# EAGLE design SchematicWeatherIC (EAGLE 9.6.2)
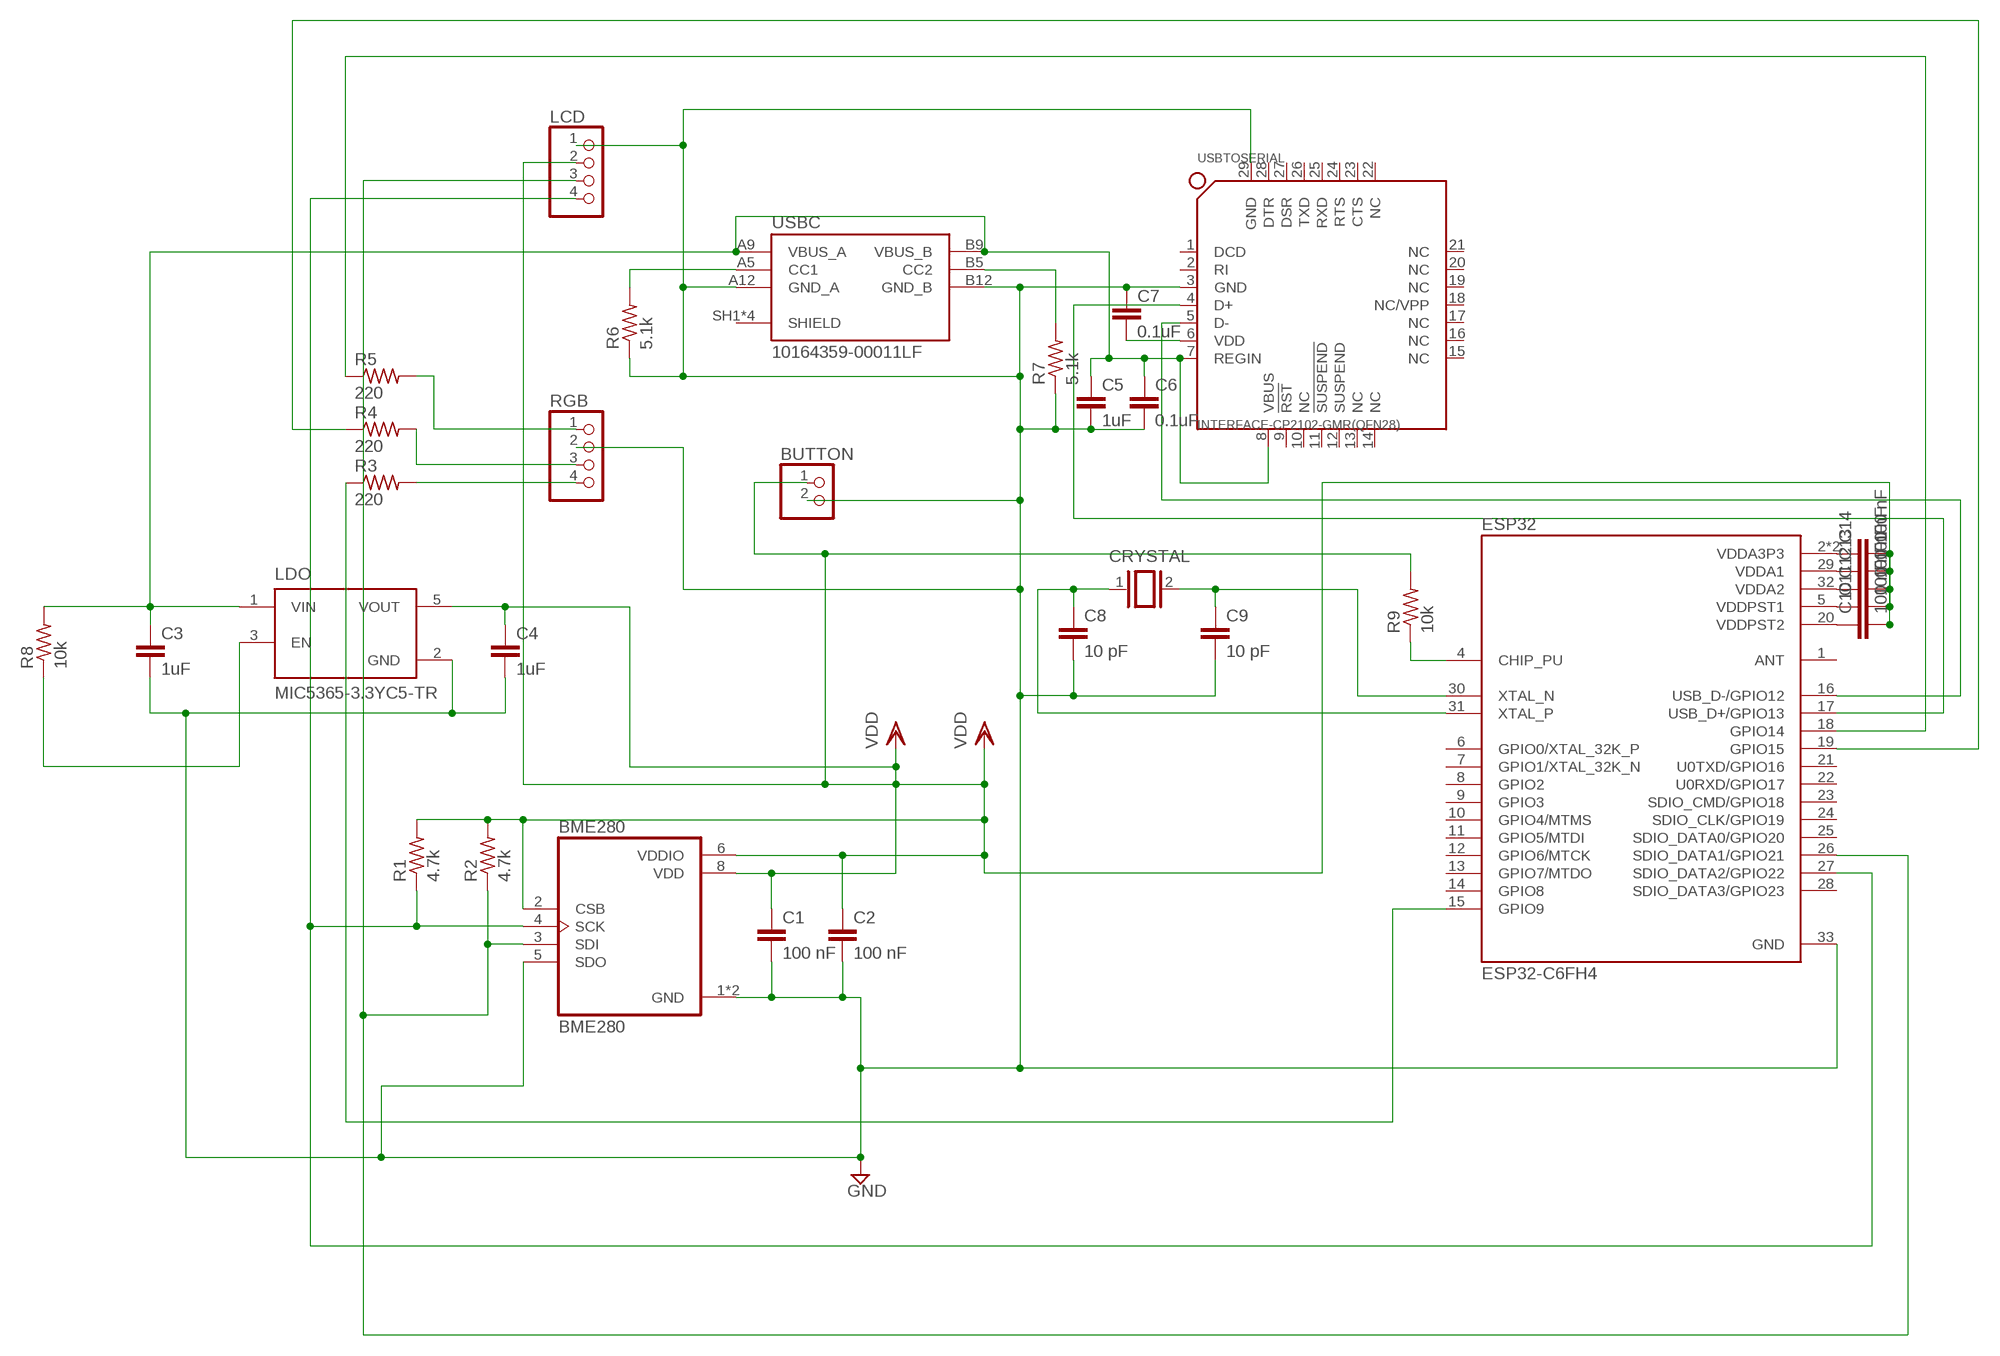
[diagram p0: schematic, sheet 1]

## Parts
BME280  BME280  [PSON65P250X250X100-8N]
BUTTON  PINHD-1X2  [1X02]
C1  100 nF  C5/3  [C5B3]
C2  100 nF  C5/3  [C5B3]
C3  1uF  C5/2.5  [C5B2.5]
C4  1uF  C5/2.5  [C5B2.5]
C5  1uF  C5/2.5  [C5B2.5]
C6  0.1uF  C5/2.5  [C5B2.5]
C7  0.1uF  C5/2.5  [C5B2.5]
C8  10 pF  C5/3  [C5B3]
C9  10 pF  C5/3  [C5B3]
C10  100 nF  C5/3  [C5B3]
C11  100 nF  C5/3  [C5B3]
C12  100 nF  C5/3  [C5B3]
C13  100 nF  C5/3  [C5B3]
C14  100 nF  C5/3  [C5B3]
CRYSTAL  XTAL/S  [QS]
ESP32  ESP32-C6FH4  [QFN50P500X500X90-33N]
LCD  PINHD-1X4  [1X04]
LDO  MIC5365-3.3YC5-TR  [SOT65P210X110-5N]
R1  4.7k  R-US_VMTA55  [VMTA55]
R2  4.7k  R-US_VMTA55  [VMTA55]
R3  220  R-US_VMTA55  [VMTA55]
R4  220  R-US_VMTA55  [VMTA55]
R5  220  R-US_VMTA55  [VMTA55]
R6  5.1k  R-US_VMTA55  [VMTA55]
R7  5.1k  R-US_VMTA55  [VMTA55]
R8  10k  R-US_VMTA55  [VMTA55]
R9  10k  R-US_VMTA55  [VMTA55]
RGB  PINHD-1X4  [1X04]
USBC  10164359-00011LF  [AMPHENOL_10164359-00011LF]
USBTOSERIAL  INTERFACE-CP2102-GMR(QFN28)  [QFN28G_0.5-5X5MM]

## Nets
D_N [differential_pair]: ESP32.16(USB_D-/GPIO12) USBTOSERIAL.5(D-)
D_P [differential_pair]: ESP32.17(USB_D+/GPIO13) USBTOSERIAL.4(D+)
GND: BME280.1(GND) BME280.5(SDO) BME280.7(GND) BUTTON.2 C1.2 C2.2 C3.2 C4.2 C5.2 C6.2 C7.1 C8.2 C9.2 ESP32.33(GND) LCD.1 LDO.2(GND) R6.1 R7.1 RGB.2 USBC.A12(GND_A) USBC.B12(GND_B) USBTOSERIAL.3(GND) USBTOSERIAL.29(GND)
N$1: ESP32.15(GPIO9) R3.1
N$2: C3.1 C5.1 C6.1 LDO.1(VIN) R8.2 USBC.A9(VBUS_A) USBC.B9(VBUS_B) USBTOSERIAL.7(REGIN) USBTOSERIAL.8(VBUS)
N$3: ESP32.4(CHIP_PU) R9.1
N$4: ESP32.18(GPIO14) R5.1
N$5: C7.2 USBTOSERIAL.6(VDD)
N$6: LDO.3(EN) R8.1
N$7: ESP32.19(GPIO15) R4.1
N$8: R3.2 RGB.4
N$9: R4.2 RGB.3
N$10: R5.2 RGB.1
N$11: C8.1 CRYSTAL.1 ESP32.31(XTAL_P)
N$12: R6.2 USBC.A5(CC1)
N$13: R7.2 USBC.B5(CC2)
N$14: C10.1 ESP32.20(VDDPST2)
N$15: C9.1 CRYSTAL.2 ESP32.30(XTAL_N)
N$16: C11.1 ESP32.5(VDDPST1)
N$17: C12.1 ESP32.32(VDDA2)
N$18: C13.1 ESP32.29(VDDA1)
N$19: C14.1 ESP32.2(VDDA3P3) ESP32.3(VDDA3P3)
SCL: BME280.4(SCK) ESP32.27(SDIO_DATA2/GPIO22) LCD.4 R1.1
SDA: BME280.3(SDI) ESP32.26(SDIO_DATA1/GPIO21) LCD.3 R2.1
VDD: BME280.2(CSB) BME280.6(VDDIO) BME280.8(VDD) BUTTON.1 C1.1 C2.1 C4.1 C10.2 C11.2 C12.2 C13.2 C14.2 LCD.2 LDO.5(VOUT) R1.2 R2.2 R9.2
Unconnected: ESP32.1(ANT) ESP32.6(GPIO0/XTAL_32K_P) ESP32.7(GPIO1/XTAL_32K_N) ESP32.8(GPIO2) ESP32.9(GPIO3) ESP32.10(GPIO4/MTMS) ESP32.11(GPIO5/MTDI) ESP32.12(GPIO6/MTCK) ESP32.13(GPIO7/MTDO) ESP32.14(GPIO8) ESP32.21(U0TXD/GPIO16) ESP32.22(U0RXD/GPIO17) ESP32.23(SDIO_CMD/GPIO18) ESP32.24(SDIO_CLK/GPIO19) ESP32.25(SDIO_DATA0/GPIO20) ESP32.28(SDIO_DATA3/GPIO23) USBC.SH1(SHIELD) USBC.SH2(SHIELD) USBC.SH3(SHIELD) USBC.SH4(SHIELD) USBTOSERIAL.1(DCD) USBTOSERIAL.2(RI) USBTOSERIAL.9(!RST) USBTOSERIAL.10(NC) USBTOSERIAL.11(!SUSPEND) USBTOSERIAL.12(SUSPEND) USBTOSERIAL.13(NC) USBTOSERIAL.14(NC) USBTOSERIAL.15(NC) USBTOSERIAL.16(NC) USBTOSERIAL.17(NC) USBTOSERIAL.18(NC/VPP) USBTOSERIAL.19(NC) USBTOSERIAL.20(NC) USBTOSERIAL.21(NC) USBTOSERIAL.22(NC) USBTOSERIAL.23(CTS) USBTOSERIAL.24(RTS) USBTOSERIAL.25(RXD) USBTOSERIAL.26(TXD) USBTOSERIAL.27(DSR) USBTOSERIAL.28(DTR)

## Library data of the parts
BME280 = BME280:BME280: DIGITAL HUMIDITY, PRESSURE AND TEMPERATURE SENSOR * Digital interface I²C (up to 3.4 MHz) and SPI (3 and 4 wire, up to 10 MHz)* Supply voltage VDD main supply voltage range: 1.71 V to 3.6 V*VDDIO interface voltage range: 1.2 V to 3.6 V Operating range -40…+85 °C, 0…100 % rel. humidity, 300…1100 hPa The library has been designed by Richard Magdycz <https://www.facebook.com/groups/eaglecadsoftUK>; AVAILABILITY: Unavailable; DESCRIPTION: Humidity Temperature Sensor 0 ~ 100% RH I²C, SPI ±3% 1s Surface Mount; MF: Bosch; MP: BME280; PACKAGE: LGA-8 Bosch; PRICE: None
BUTTON = pinhead:PINHD-1X2: PIN HEADER
C1-C14 = capacitor-wima:C: CAPACITOR naming: grid - package width
CRYSTAL = special:XTAL/S: CRYSTAL
ESP32 = ESP32-C6FH4 (IC):ESP32-C6FH4; MANUFACTURER: Espressif Systems; MAXIMUM_PACKAGE_HEIGHT: 0.9mm; PARTREV: v0.5; SNAPEDA_PN: ESP32-C6FH4; STANDARD: IPC-7351B
LCD RGB = pinhead:PINHD-1X4: PIN HEADER
LDO = MIC5365-3.3YC5-TR:MIC5365-3.3YC5-TR; MANUFACTURER: Micrel; MAXIMUM_PACKAGE_HEIGHT: 1.10mm; PARTREV: 3.1 - July 16, 2013; STANDARD: IPC 7351B
R1-R9 = rcl:R-US_: RESISTOR, American symbol; SPICEPREFIX: R
USBC = 10164359-00011LF:10164359-00011LF; MANUFACTURER: Amphenol; MAXIMUM_PACKAGE_HEIGHT: 3.26 mm; PARTREV: A; STANDARD: Manufacturer Recommendations
USBTOSERIAL = INTERFACE-CP2102-GMR_QFN28_:INTERFACE-CP2102-GMR(QFN28); MPN: CP2102-GMR

## Board
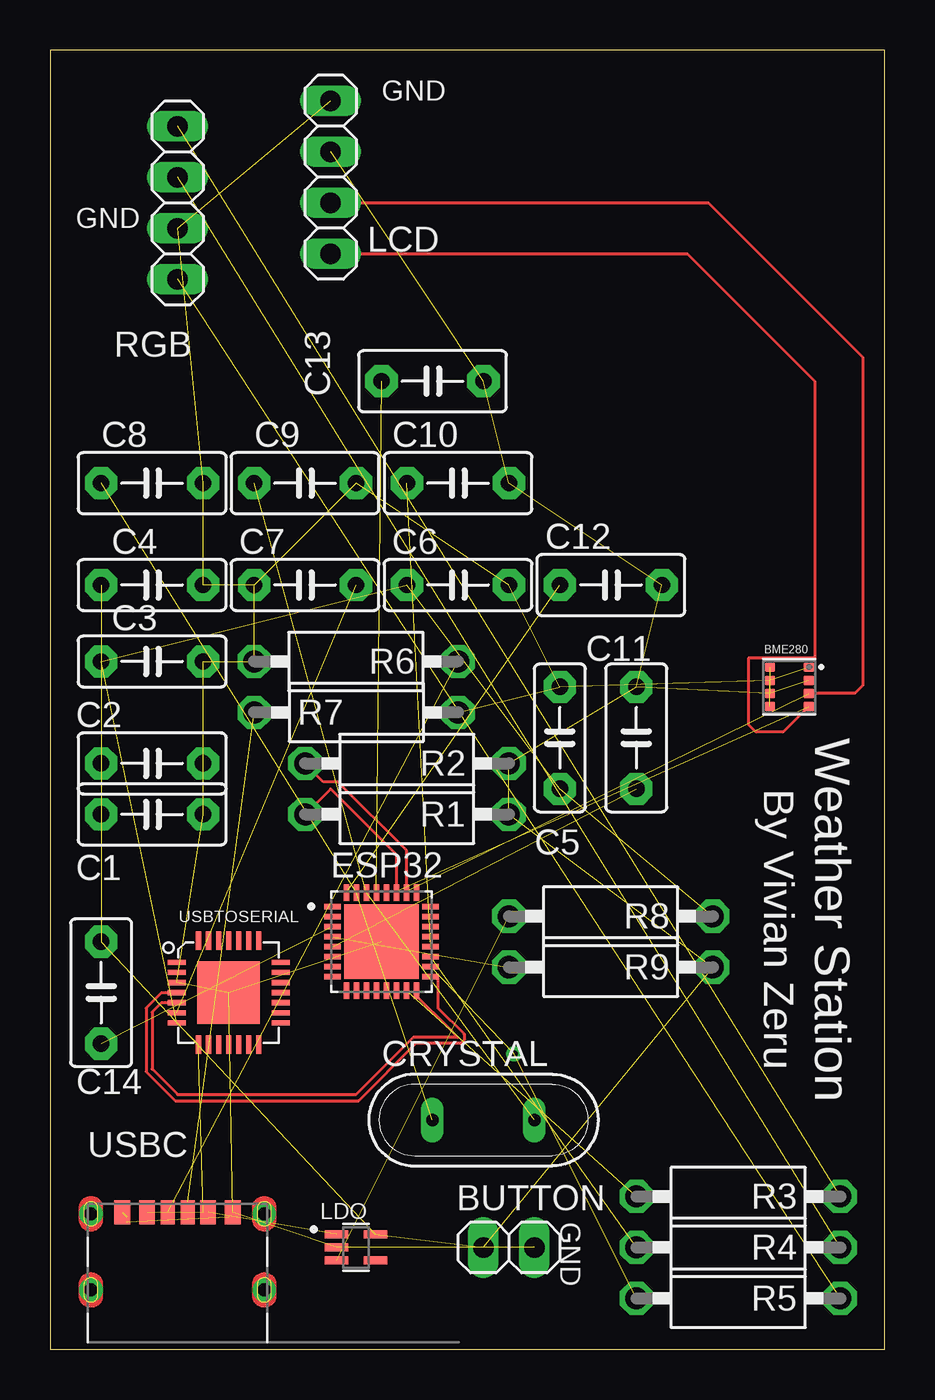
[diagram p1: board, top side]
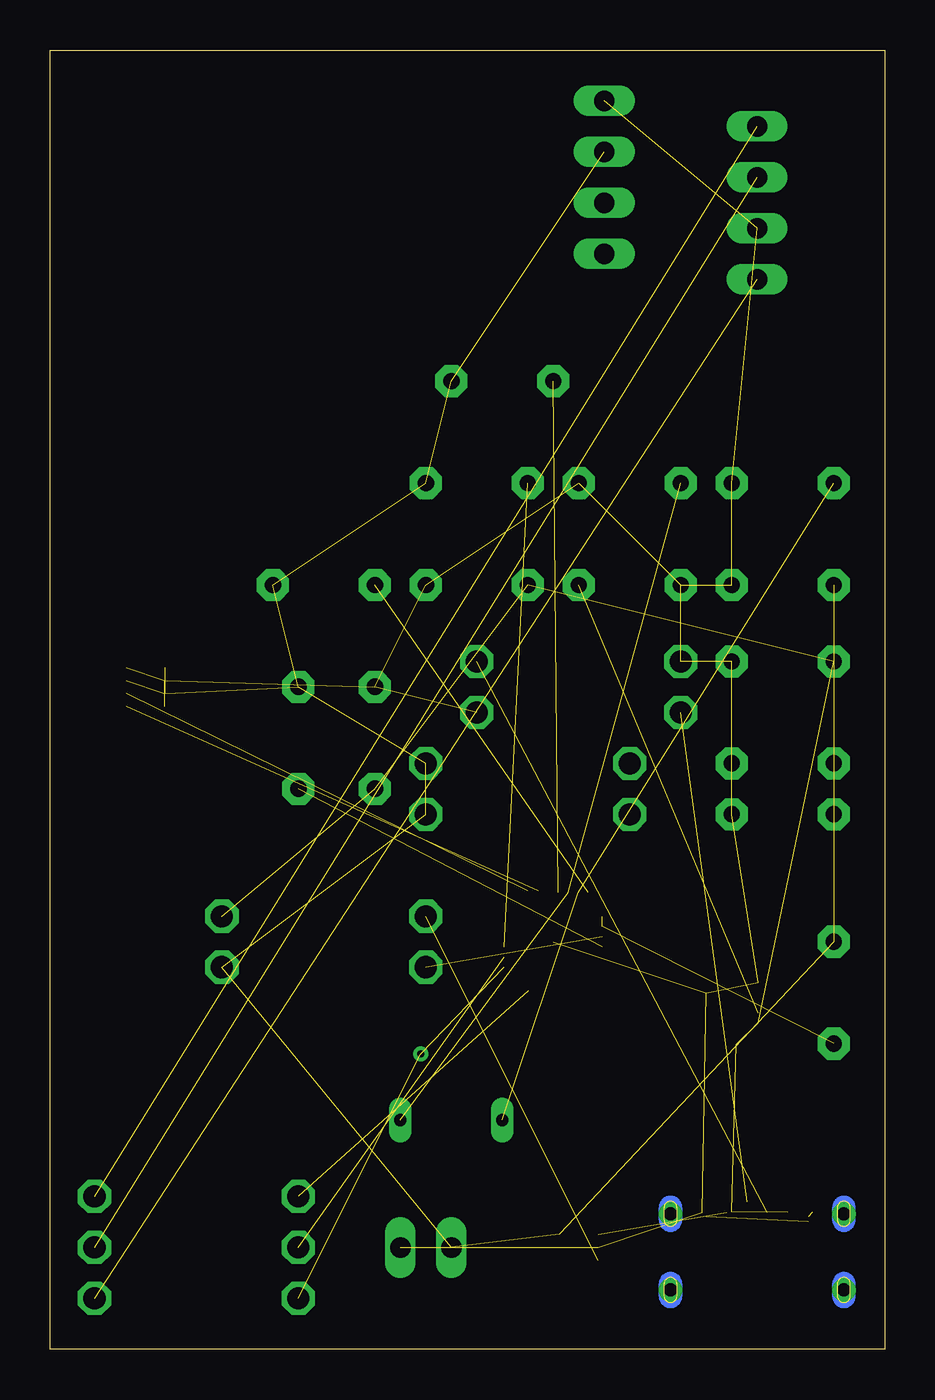
[diagram p2: board, bottom side, seen from below]

Size 41.58 x 64.76 mm. Coordinates in mm from the lower left corner, seen from the top.
Outline: 0,0 41.58,0 41.58,64.76 0,64.76 0,0
Copper layers (1*16): Top 0.035mm / dielectric 1.5mm / Bottom 0.035mm
Design rules "default": minimum track width 6mil, minimum drill 0.35mm, track to track 6mil, track to pad 6mil, pad to pad 6mil, via to via 6mil, smd to smd 6mil, copper to edge 40mil, drill to drill 6mil, minimum pad ring 10mil, minimum via ring 8mil, stop-mask expansion 4mil, vias tented up to drill 0mil, thermal gap 10mil

### Footprints (pad centres in the part's own frame; a part is rotated, then mirrored left to right if it is on the bottom)
PSON65P250X250X100-8N = smd 0.49 x 0.45: 1 0.97,0.975; 2 0.97,0.325; 3 0.97,-0.325; 4 0.97,-0.975; 5 -0.97,-0.975; 6 -0.97,-0.325; 7 -0.97,0.325; 8 -0.97,0.975
1X02 = drill 1.016 long: 1 -1.27,0; 2 1.27,0
C5B3 = drill 0.813 pad 1.6 octagon: 1 -2.54,0; 2 2.54,0
C5B2.5 = drill 0.813 pad 1.6 octagon: 1 -2.54,0; 2 2.54,0
QS = drill 0.61 long: 1 -2.54,0; 2 2.54,0
QFN50P500X500X90-33N = smd 0.81 x 0.27: 1 -2.445,1.75; 2 -2.445,1.25; 3 -2.445,0.75; 4 -2.445,0.25; 5 -2.445,-0.25; 6 -2.445,-0.75; 7 -2.445,-1.25; 8 -2.445,-1.75; 17 2.445,-1.75; 18 2.445,-1.25; 19 2.445,-0.75; 20 2.445,-0.25; 21 2.445,0.25; 22 2.445,0.75; 23 2.445,1.25; 24 2.445,1.75 | smd 0.27 x 0.81: 9 -1.75,-2.445; 10 -1.25,-2.445; 11 -0.75,-2.445; 12 -0.25,-2.445; 13 0.25,-2.445; 14 0.75,-2.445; 15 1.25,-2.445; 16 1.75,-2.445; 25 1.75,2.445; 26 1.25,2.445; 27 0.75,2.445; 28 0.25,2.445; 29 -0.25,2.445; 30 -0.75,2.445; 31 -1.25,2.445; 32 -1.75,2.445 | smd 3.7 x 3.7: 33 0,0
1X04 = drill 1.016 long: 1 -3.81,0; 2 -1.27,0; 3 1.27,0; 4 3.81,0
SOT65P210X110-5N = smd 1.17 x 0.4: 1 -0.97,0.65; 2 -0.97,0; 3 -0.97,-0.65; 4 0.97,-0.65; 5 0.97,0.65
VMTA55 = drill 1.1 octagon: 1 -5.08,0; 2 5.08,0
AMPHENOL_10164359-00011LF = smd 0.7 x 1.2: A5 -0.5,3.03; B5 0.5,3.03 | smd 0.76 x 1.2: A9 1.52,3.03; B9 -1.52,3.03 | smd 0.8 x 1.2: A12 2.75,3.03; B12 -2.75,3.03 | drill 0.65 pad 1.15: SH1 -4.32,2.95; SH2 4.32,2.95; SH3 -4.32,-0.85; SH4 4.32,-0.85
QFN28G_0.5-5X5MM = smd 0.9 x 0.254: 1 -2.59,1.5; 2 -2.59,1; 3 -2.59,0.5; 4 -2.59,0; 5 -2.59,-0.5; 6 -2.59,-1; 7 -2.59,-1.5; 15 2.59,-1.5; 16 2.59,-1; 17 2.59,-0.5; 18 2.59,0; 19 2.59,0.5; 20 2.59,1; 21 2.59,1.5 | smd 0.254 x 0.9: 8 -1.5,-2.59; 9 -1,-2.59; 10 -0.5,-2.59; 11 0,-2.59; 12 0.5,-2.59; 13 1,-2.59; 14 1.5,-2.59; 22 1.5,2.59; 23 1,2.59; 24 0.5,2.59; 25 0,2.59; 26 -0.5,2.59; 27 -1,2.59; 28 -1.5,2.59 | smd 3.1 x 3.1: 29 0,0

### Placement (x,y rotation side)
BME280  36.83,33.02 0 top
BUTTON  22.86,5.08 0 top
C1  5.08,26.67 0 top
C2  5.08,29.21 0 top
C3  5.08,34.29 0 top
C4  5.08,38.1 0 top
C5  25.4,30.48 90 top
C6  20.32,38.1 0 top
C7  12.7,38.1 0 top
C8  5.08,43.18 0 top
C9  12.7,43.18 0 top
C10  20.32,43.18 0 top
C11  29.21,30.48 90 top
C12  27.94,38.1 0 top
C13  19.05,48.26 0 top
C14  2.54,17.78 90 top
CRYSTAL  21.59,11.43 0 top
ESP32  16.51,20.32 0 top
LCD  13.97,58.42 270 top
LDO  15.24,5.08 0 top
R1  17.78,26.67 0 top
R2  17.78,29.21 0 top
R3  34.29,7.62 0 top
R4  34.29,5.08 0 top
R5  34.29,2.54 0 top
R6  15.24,34.29 0 top
R7  15.24,31.75 180 top
R8  27.94,21.59 0 top
R9  27.94,19.05 0 top
RGB  6.35,57.15 90 top
USBC  6.35,3.81 0 top
USBTOSERIAL  8.89,17.78 0 top

### Tracks (layer width: path | path; a pad name or v marks a point on that pad's centre or on a via)
D_N
  Top 0.152: USBTOSERIAL.5 5.54,17.28 5.08,16.82 5.08,13.97 6.35,12.7 15.24,12.7 18.09,15.54 20.32,15.54 19.78,16.09 | 19.78,16.09 | 19.78,16.09 18.26,17.61 ESP32.16
D_P
  Top 0.152: USBTOSERIAL.4 5.54,17.78 4.78,17.01 4.78,13.84 6.22,12.39 15.37,12.39 18.21,15.24 20.45,15.24 20.62,15.42 20.62,15.71 19.32,17.02 19.32,18.47 19.23,18.57 ESP32.17
GND  (23 unrouted)
  Top 0.152: 3.81,6.35 3.81,6.6 | 8.89,6.6 USBC.A12
N$1  (1 unrouted)
N$2  (8 unrouted)
  Top 0.152: 7.62,6.86 USBC.A9 7.62,6.6
N$3  (1 unrouted)
N$4  (via drill 0.35)  (2 unrouted)
  other vias: 23.11,14.73
N$5  (1 unrouted)
N$6  (1 unrouted)
N$7  (1 unrouted)
N$8  (1 unrouted)
N$9  (1 unrouted)
N$10  (1 unrouted)
N$11  (2 unrouted)
N$12  (1 unrouted)
  Top 0.152: 6.1,6.6 USBC.A5
N$13  (1 unrouted)
  Top 0.152: 6.86,7.37 6.86,6.86 USBC.B5
N$14  (1 unrouted)
N$15  (2 unrouted)
N$16  (1 unrouted)
N$17  (1 unrouted)
N$18  (1 unrouted)
N$19  (2 unrouted)
SCL  (1 unrouted)
  Top 0.152: 37.85,32 BME280.4 36.53,30.77 35.15,30.77 34.79,31.14 34.79,34.45 38.1,34.45 38.1,48.26 31.75,54.61 LCD.4 | 17.27,22.86 ESP32.27 17.26,24.65 13.97,27.94 R1.1
SDA  (1 unrouted)
  Top 0.152: ESP32.26 17.78,22.86 | BME280.3 40.1,32.7 40.49,33.09 40.49,49.46 32.8,57.15 LCD.3 | ESP32.26 17.78,22.79 | ESP32.26 17.76,24.86 14.32,28.29 13.62,28.29 R2.1
VDD  (16 unrouted)

### Text on the board
tPlace: GND | GND | Weather Station | By Vivian Zeru | GND